# EasyEDA Pro project compute-module-v101.eprj, board base-board-5x
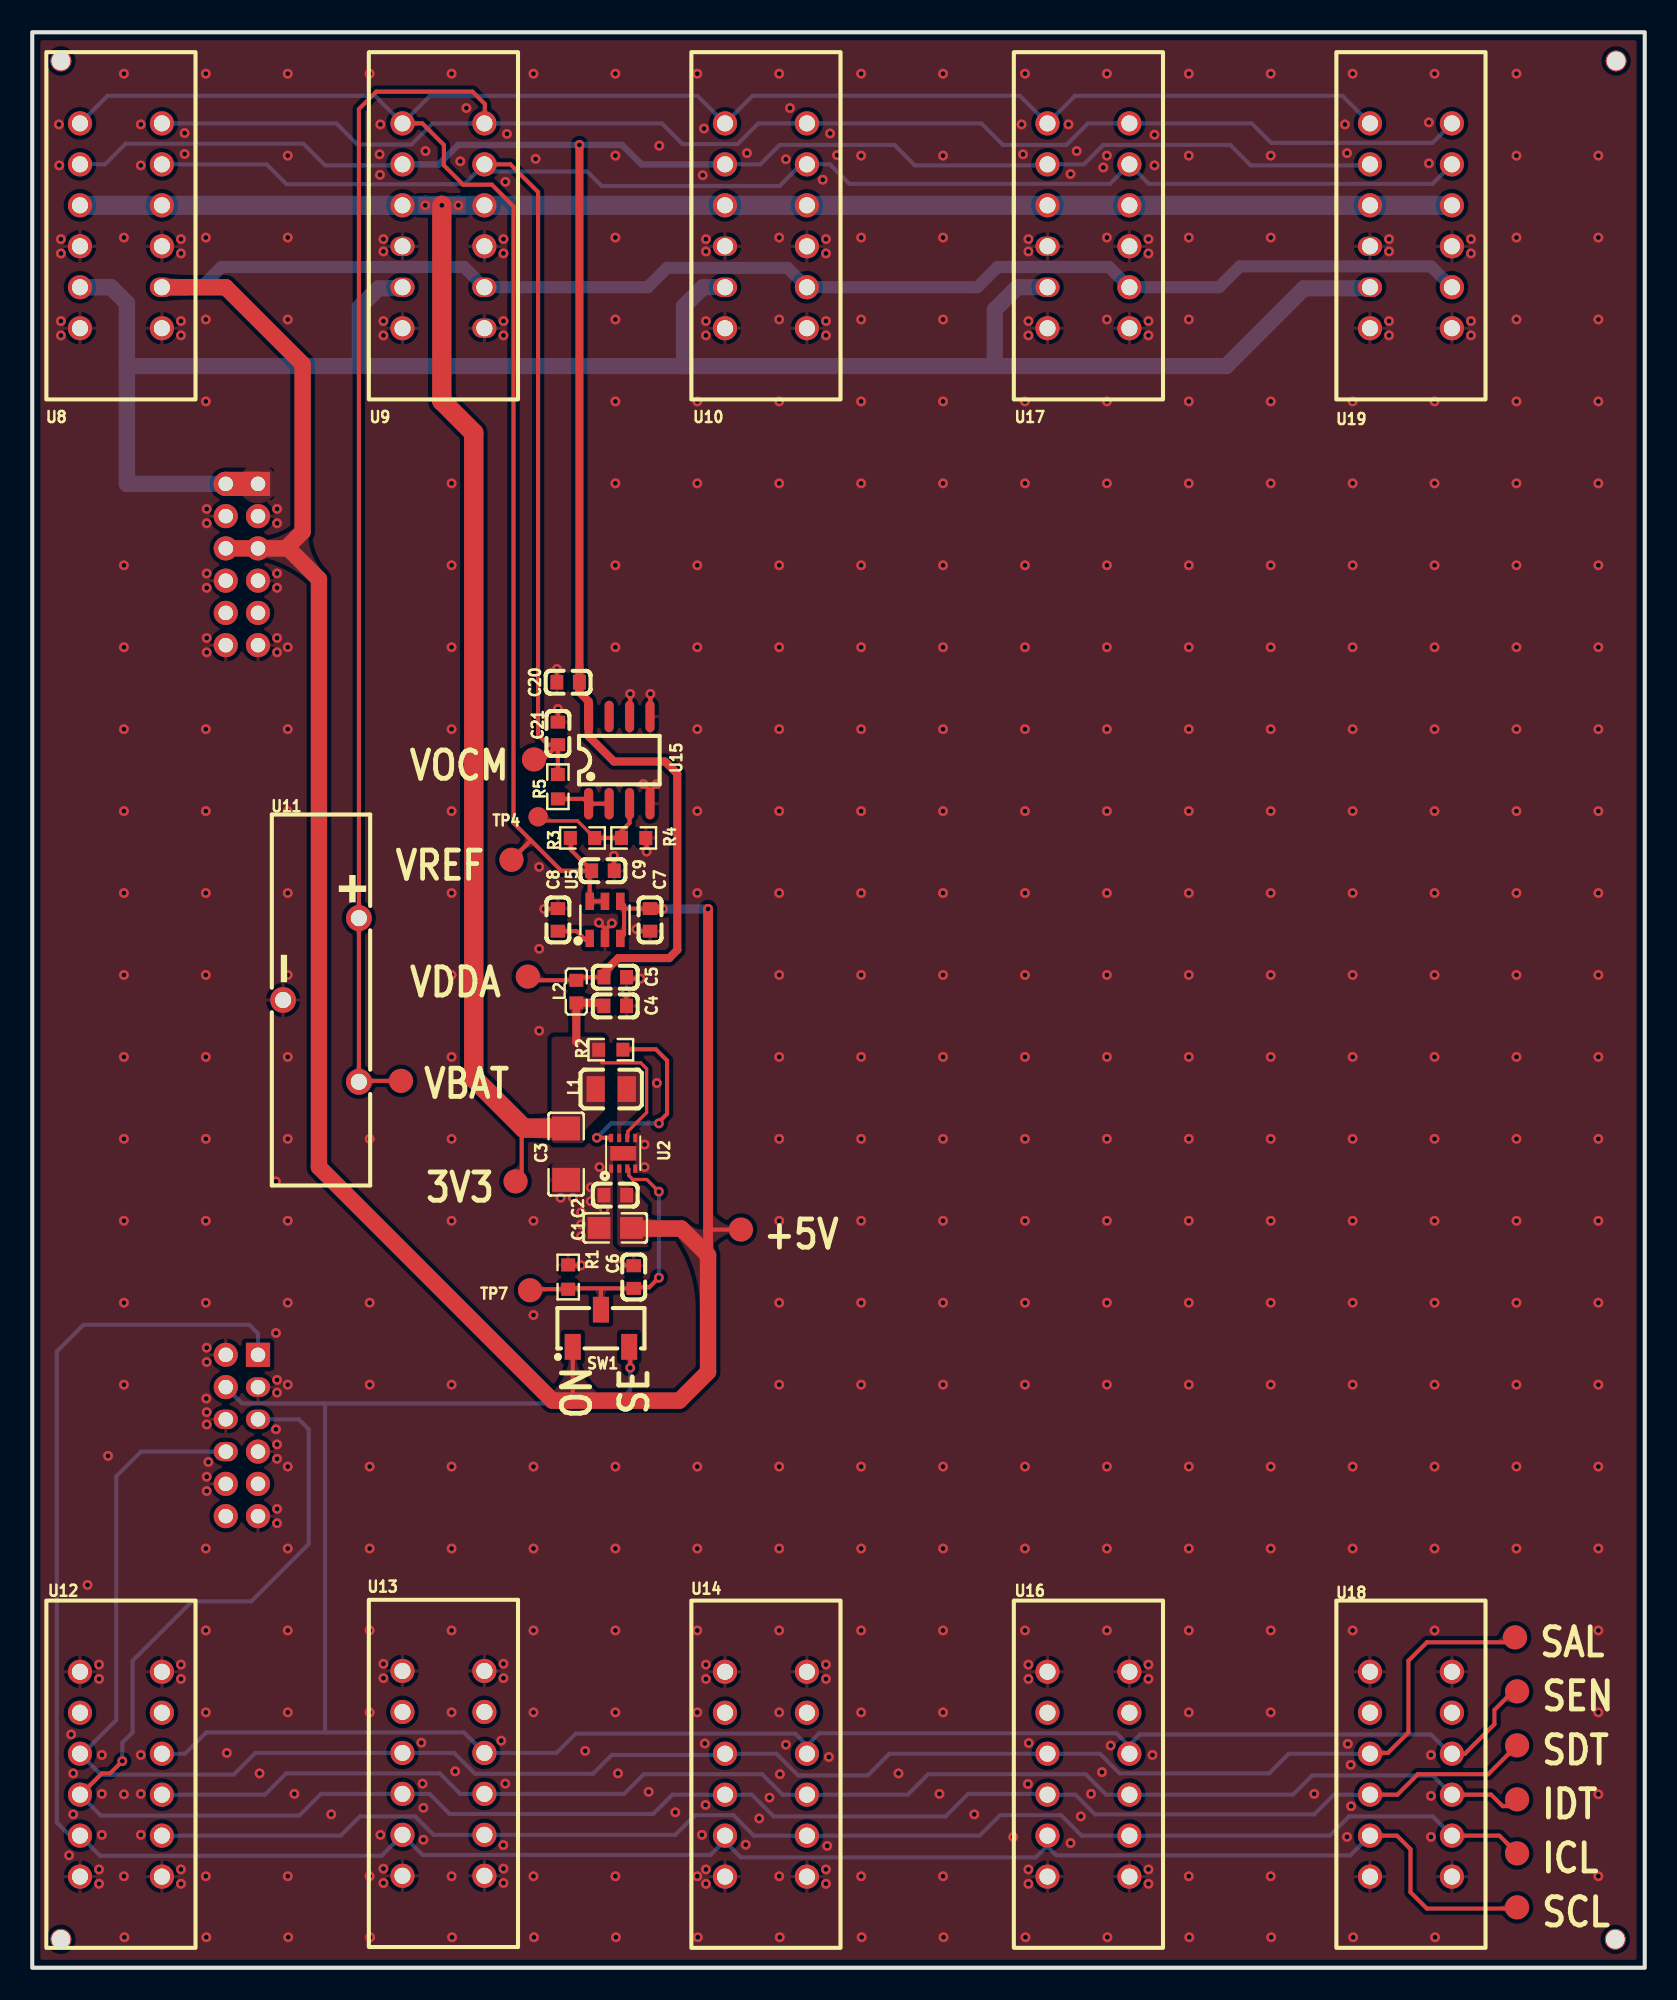
[diagram p6: board, top side]
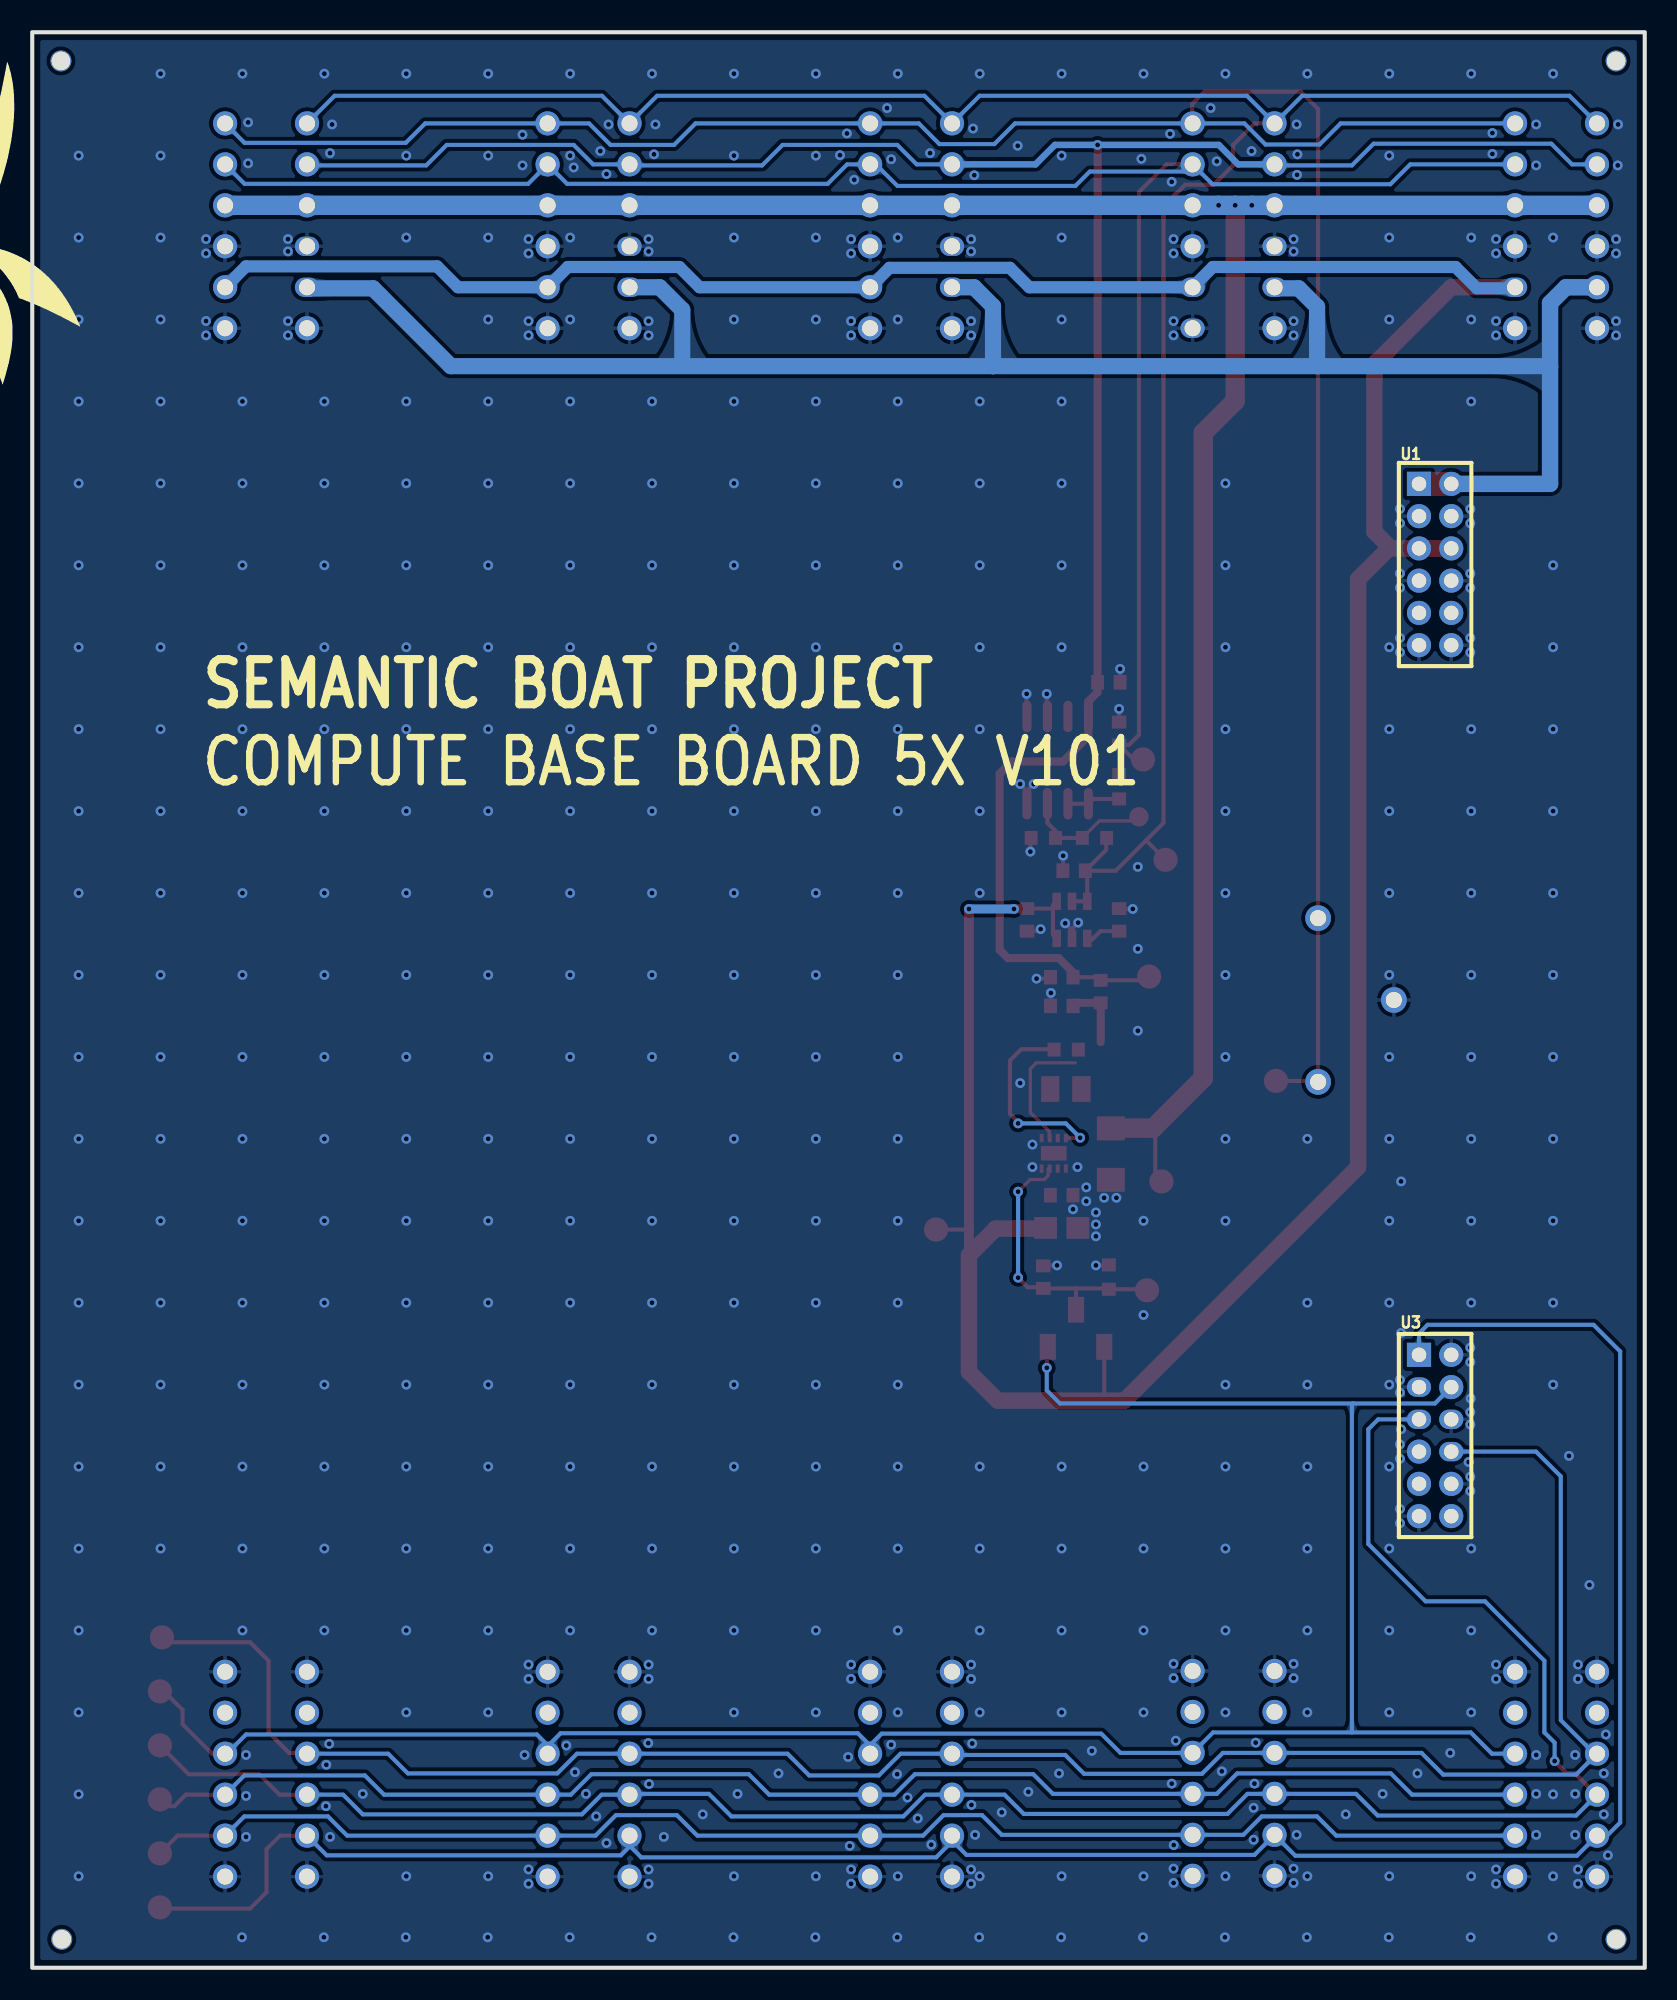
[diagram p7: board, bottom side, seen from below]

Outline 100 x 120 mm; copper layers: Top Layer, Inner1, Inner2, Bottom Layer. Coordinates in mm from the lower left corner of the outline.
Outline path: rectangle 0,120 100,0
Stack: Top Layer 0.035mm Outer layer thickness 1oz / Dielectric1 0.2104mm 7628 RC49% 8.6mil / Inner1 0.0152mm Inner layer thickness / Dielectric2 1.065mm 1.1mm H/HOZ Copper / Inner2 0.0152mm Inner layer thickness / Dielectric3 0.2104mm 7628 RC49% 8.6mil / Bottom Layer 0.035mm Outer layer thickness 1oz

## Design rules (mm)
template: JLCPCB Capability(Two Layers Board)
spacing copperThickness1oz (default): track to track 0.102, other pairs 0.152 to 0.3
spacing copperThickness2oz: track to track 0.203, other pairs 0.152 to 0.3
track width copperThickness1oz (default): min 0.127, default 0.254, max 2.54
track width copperThickness2oz: min 0.203, default 0.254, max 2.54
differential pair differentialPair (default): width min 0.127, default 0.254, max 2.54; gap min 0.152, default 0.152
via viaSize (default): diameter min 0.5, default 0.61, max 10; hole min 0.3, default 0.305, max 6.3

## Placement (name value [footprint] x y rotation side)
C1  10uF  [C0805]  36.16 45.87 180 top
C2  100nF  [C0603]  36.16 47.9 180 top
C3  22uF  [C1206]  33.11 50.44 270 top
C4  100nF  [C0603]  36.15 59.63 180 top
C5  100nF  [C0603]  36.15 61.41 180 top
C6  100nF  [C0603]  37.3 42.82 90 top
C7  100nF  [C0603]  38.31 64.97 270 top
C8  100nF  [C0603]  32.6 64.97 90 top
C9  100nF  [C0603]  35.39 68.02 0 top
C20  100nF  [C0603]  33.23 79.7 180 top
C21  2.2uF  [C0603]  32.6 76.53 90 top
L1  2.2uH  [IND-SMD_L2.0-W1.6-1]  35.9 54.48 180 top
L2  BLM18KG601SN1D  [L0603]  33.74 60.52 90 top
NOREF  -  [Pad_e13858]  98.22 118.22 180 top
NOREF#2  -  [Pad_e13859]  1.78 118.22 270 top
NOREF#3  -  [Pad_e13856]  1.78 1.76 0 top
NOREF#4  -  [Pad_e13857]  98.17 1.76 90 top
R1  100kΩ  [R0603]  33.24 42.82 90 top
R2  100kΩ  [R0603]  35.88 56.92 180 top
R3  10kΩ  [R0603]  34.12 70.05 0 top
R4  10kΩ  [R0603]  37.3 70.05 0 top
R5  10Ω  [R0603]  32.6 73.22 90 top
SW1  CAS-120A  [SW-SMD_CAS-120A]  35.27 39.65 0 top
TP1  -  [Test-Point-0.5mm#2]  29.72 68.69 0 top
TP2  -  [Test-Point-0.5mm#2]  43.95 45.77 0 top
TP3  -  [Test-Point-0.5mm#2]  31.12 74.92 0 top
TP4  -  [Test-Point-0.5mm]  31.37 71.36 0 top
TP5  -  [Test-Point-0.5mm#2]  29.97 48.75 0 top
TP6  -  [Test-Point-0.5mm#2]  30.73 61.45 0 top
TP7  -  [Test-Point-0.5mm#2]  30.87 42 0 top
TP8  -  [Test-Point-0.5mm#2]  92.08 17.13 0 top
TP9  -  [Test-Point-0.5mm#2]  91.96 20.48 0 top
TP10  -  [Test-Point-0.5mm#2]  92.08 3.74 0 top
TP11  -  [Test-Point-0.5mm#2]  92.08 13.79 0 top
TP13  -  [Test-Point-0.5mm#2]  22.87 54.99 0 top
TP14  -  [Test-Point-0.5mm#2]  92.08 7.09 0 top
TP15  -  [Test-Point-0.5mm#2]  92.08 10.44 0 top
U1  2005FV-2x6P  [HDR-TH_12P-P2.00-V-F-R2-C6-S2.00]  13 87 270 bottom
U2  TPS62162DSGR  [WSON-8_L2.0-W2.0-P0.50-TL-EP]  36.65 50.49 90 top
U3  2005FV-2x6P  [HDR-TH_12P-P2.00-V-F-R2-C6-S2.00#2]  13 33 270 bottom
U5  ZJR1001-3BUTBR  [SOT-23-6_L2.9-W1.6-P0.95-LS2.9-BL]  35.52 64.97 0 top
U8  ED12BGFBK  [CONN-TH_12P-P2.54_WINGTAT_ED12BGFBK#2]  5.5 108 90 top
U9  ED12BGFBK  [CONN-TH_12P-P2.54_WINGTAT_ED12BGFBK#3]  25.5 108 90 top
U10  ED12BGFBK  [CONN-TH_12P-P2.54_WINGTAT_ED12BGFBK]  45.5 108 90 top
U11  VBH2032-1  [BAT-TH_3P-L23.0-W6.0_VBH2032-1]  17.91 60 270 top
U12  ED12BGFBK  [CONN-TH_12P-P2.54_WINGTAT_ED12BGFBK#4]  5.5 12 90 top
U13  ED12BGFBK  [CONN-TH_12P-P2.54_WINGTAT_ED12BGFBK#4]  25.5 12.05 90 top
U14  ED12BGFBK  [CONN-TH_12P-P2.54_WINGTAT_ED12BGFBK#4]  45.5 12 90 top
U15  TLV9062IDR  [SOIC-8_L5.0-W4.0-P1.27-LS6.0-BL]  36.41 74.87 0 top
U16  ED12BGFBK  [CONN-TH_12P-P2.54_WINGTAT_ED12BGFBK#4]  65.5 12 90 top
U17  ED12BGFBK  [CONN-TH_12P-P2.54_WINGTAT_ED12BGFBK]  65.5 108 90 top
U18  ED12BGFBK  [CONN-TH_12P-P2.54_WINGTAT_ED12BGFBK#4]  85.5 12 90 top
U19  ED12BGFBK  [CONN-TH_12P-P2.54_WINGTAT_ED12BGFBK]  85.5 108 90 top

## Footprints (pads in the part's own frame, mm; a bottom-side part is the same pattern mirrored in y, then rotated)
BAT-TH_3P-L23.0-W6.0_VBH2032-1
  round 1.6 hole 1: 1(-5.075,2.35) 2(5.075,2.35) 3(0,-2.35)
C0603
  rect 0.8x0.9 smd: 1(-0.7,0) 2(0.7,0)
C0805
  rect 1.41x1.35 smd: 1(-1,0) 2(1,0)
C1206
  rect 1.485x1.728 smd: 1(-1.593,0) 2(1.593,0)
CONN-TH_12P-P2.54_WINGTAT_ED12BGFBK
  round 1.5 hole 1: 1(-6.35,2.54) 4(1.27,2.54) 5(3.81,2.54) 6(6.35,2.54) 7(6.35,-2.54) 8(3.81,-2.54) 9(1.27,-2.54) 10(-1.27,-2.54) 11(-3.81,-2.54) 12(-6.35,-2.54)
  oval 1.2x1.5 hole 1: 2(-3.81,2.54) 3(-1.27,2.54)
CONN-TH_12P-P2.54_WINGTAT_ED12BGFBK#2
  round 1.5 hole 1: 1(-6.35,2.54) 2(-3.81,2.54) 3(-1.27,2.54) 4(1.27,2.54) 5(3.81,2.54) 6(6.35,2.54) 7(6.35,-2.54) 8(3.81,-2.54) 9(1.27,-2.54) 10(-1.27,-2.54) 12(-6.35,-2.54)
  oval 1.2x1.5 hole 1: 11(-3.81,-2.54)
CONN-TH_12P-P2.54_WINGTAT_ED12BGFBK#3
  round 1.5 hole 1: 1(-6.35,2.54) 4(1.27,2.54) 5(3.81,2.54) 6(6.35,2.54) 7(6.35,-2.54) 8(3.81,-2.54) 9(1.27,-2.54) 10(-1.27,-2.54)
  oval 1.2x1.5 hole 1: 2(-3.81,2.54) 3(-1.27,2.54) 11(-3.81,-2.54) 12(-6.35,-2.54)
CONN-TH_12P-P2.54_WINGTAT_ED12BGFBK#4
  round 1.5 hole 1: 1(-6.35,2.54) 2(-3.81,2.54) 3(-1.27,2.54) 4(1.27,2.54) 5(3.81,2.54) 6(6.35,2.54) 7(6.35,-2.54) 8(3.81,-2.54) 9(1.27,-2.54) 10(-1.27,-2.54) 11(-3.81,-2.54) 12(-6.35,-2.54)
HDR-TH_12P-P2.00-V-F-R2-C6-S2.00
  rect 1.5x1.5 hole 0.9: 1(-5,-1)
  round 1.5 hole 0.9: 2(-5,1) 3(-3,-1) 4(-3,1) 5(-1,-1) 6(-1,1) 7(1,-1) 8(1,1) 9(3,-1) 10(3,1) 11(5,-1) 12(5,1)
HDR-TH_12P-P2.00-V-F-R2-C6-S2.00#2
  rect 1.5x1.5 hole 0.9: 1(-5,-1)
  round 1.5 hole 0.9: 2(-5,1) 4(-3,1) 7(1,-1) 9(3,-1) 10(3,1) 11(5,-1) 12(5,1)
  oval 1.2x1.5 hole 0.9: 3(-3,-1) 5(-1,-1) 6(-1,1) 8(1,1)
IND-SMD_L2.0-W1.6-1
  rect 1.133x1.6 smd: 1(-0.967,0) 2(0.967,0)
L0603
  rect 0.8x0.864 smd: 1(-0.7,0) 2(0.7,0)
Pad_e13856
  round 1.3 hole 1.152: 1(0,0)
Pad_e13857
  round 1.3 hole 1.152: 1(0,0)
Pad_e13858
  round 1.3 hole 1.152: 1(0,0)
Pad_e13859
  round 1.3 hole 1.152: 1(0,0)
R0603
  rect 0.806x0.864 smd: 1(-0.753,0) 2(0.753,0)
SOIC-8_L5.0-W4.0-P1.27-LS6.0-BL
  oval 0.569x1.95 smd: 1(-1.905,-2.705) 2(-0.635,-2.705) 3(0.635,-2.705) 4(1.905,-2.705) 5(1.905,2.705) 6(0.635,2.705) 7(-0.635,2.705) 8(-1.905,2.705)
SOT-23-6_L2.9-W1.6-P0.95-LS2.9-BL
  rect 0.532x1.072 smd: 1(-0.95,-1.149) 2(0,-1.149) 3(0.95,-1.149) 4(0.95,1.149) 5(0,1.149) 6(-0.95,1.149)
SW-SMD_CAS-120A
  rect 1x1.6 smd: 1(-1.75,-1.15) 2(0,1.15) 3(1.75,-1.15)
Test-Point-0.5mm
  round 1.2 smd: 1(0,0)
Test-Point-0.5mm#2
  round 1.5 smd: 1(0,0)
WSON-8_L2.0-W2.0-P0.50-TL-EP
  rect 0.521x0.25 smd: 1(-0.95,0.75) 2(-0.95,0.25) 3(-0.95,-0.25) 4(-0.95,-0.75) 5(0.95,-0.75) 6(0.95,-0.25) 7(0.95,0.25) 8(0.95,0.75)
  rect 0.9x1.6 smd: 9(0,0)

## Nets
As in the schematic.

Pads without a net: NOREF 1; NOREF#2 1; NOREF#3 1; NOREF#4 1; U1 9 10; U3 9 12; U12 5 8; U13 5 8; U14 5 8; U15 7; U16 5 8; U18 5 8

## Via types
v1: diameter 0.61, hole 0.305, Top Layer to Bottom Layer, 586 vias

## Routing (per net, layer and track width the routed paths; a pad name or vN(x,y) marks a point on that pad's centre or on a via; arc(x,y) is an arc through that point)
+3V3: length 162.2
  Top Layer w0.2: U2.6 36.9,51.49 36.93,51.52 36.93,51.85 37.55,52.47 37.55,52.47 38.1,53.02 38.1,55.74 37.73,56.11 35.32,56.11
  Top Layer w0.254: TP5.1 30.35,49.13 30.35,51.8
  Top Layer w0.5: C4.2 35.26,59.82 L2.1 33.74,57.39
  Top Layer w1.2: v1(25.4,109.27) 25.4,97.14 27.38,95.16 27.38,55.16 30.48,52.06 33.09,52.06 C3.1
  Bottom Layer w1.2: U19.9 U19.4 U17.9 U17.4 U10.9 U10.4 U9.9 v1(26.43,109.27) v1(25.4,109.27) v1(24.37,109.27) U9.4 U8.9 U8.4
+5V: length 227.9
  Top Layer w0.254: C7.1 36.73,65.67 36.7,65.64 ; SW1.1 33.52,35.18 33.5,35.16 ; U5.4 36.7,65.88 36.7,65.64 ; 36.7,65.64 36.7,64.05 U5.3 ; TP2.1 41.85,45.77 41.78,45.7
  Top Layer w0.559: C7.1 38.34,65.64 v1(39.12,65.64)
  Top Layer w0.61: 41.91,44.17 v1(41.91,65.64)
  Top Layer w1.016: 15.88,88 17.78,86.09 17.78,49.64 32.26,35.16 40.13,35.16 41.91,36.94 41.91,44.17 40.25,45.83 37.2,45.83 C1.1 ; U8.11 12,104.19 16.76,99.43 16.76,89.03 15.73,88 U1.5 U1.6
  Bottom Layer w0.559: v1(41.91,65.64) v1(39.12,65.64)
  Bottom Layer w0.75: U19.11 86.75,105.48 74.89,105.48 73.6,104.19 U17.11 66.78,105.45 59.87,105.45 58.61,104.19 U10.11 46.84,105.39 39.37,105.39 38.16,104.19 U9.11 26.78,105.45 11.73,105.45 10.41,104.12 8.11,104.12 U8.11
+12V: length 122.6
  Top Layer w1.5: U1.2 U1.1
  Bottom Layer w1: U9.2 22.89,104.12 21.46,104.12 20.32,102.98 20.32,99.3 ; 59.69,99.43 59.69,102.79 61.09,104.19 U17.2 ; 40.42,99.3 40.42,99.3 40.42,103.01 41.59,104.19 U10.2 ; 40.42,99.3 74.04,99.3 78.87,104.12 82.9,104.12 U19.2 ; 40.42,99.3 20.32,99.3 ; 20.32,99.3 5.9,99.3 5.87,99.27
  Bottom Layer w1.016: U8.2 4.89,104.19 5.87,103.21 5.87,92 U1.2
GND: length 15.2
  Top Layer w0.254: U15.5 38.33,77.6 v1(38.33,78.98) ; v1(37.47,64.39) 37.59,64.27 C7.2 ; v1(38.74,73.39) 38.31,72.97 ; 38.31,72.97 38.31,72.97 v1(37.9,73.39) ; 38.31,72.97 U15.4 ; v1(32.6,78.05) 32.6,77.22 ; C9.2 36.07,68.04 v1(36.07,68.95) ; R1.2 33.27,43.55 v1(34.04,43.55) ; v1(38.1,69.2) 38.1,70 R4.2 ; v1(35.14,64.8) 35.52,64.42 35.52,64.33 ; C8.2 32.57,65.64 v1(31.75,65.64) ; 37.04,77.58 37.08,77.62 v1(37.08,78.98) ; v1(36.83,60.44) 36.83,59.66 C4.1 ; C5.1 36.94,61.33 v1(37.72,61.33) ; 35.52,64.33 U5.2 ; 35.52,64.33 v1(35.94,64.75) ; 32.53,79.7 32.54,79.7 v1(32.54,80.53) ; C6.2 37.28,43.55 v1(36.45,43.55)
  vias: v1(1.65,114.28) v1(1.68,111.75) v1(1.78,107.17) v1(1.78,106.28) v1(1.78,102.09) v1(1.78,101.2) v1(2.29,6.97) v1(2.41,14.46) v1(2.54,12.05) v1(2.54,9.51) v1(3.43,23.73) v1(4.14,18.8) v1(4.14,17.91) v1(4.14,6.1) v1(4.14,5.21) v1(4.32,13.19) v1(4.32,10.78) v1(4.32,8.24) v1(4.7,31.74) v1(5.68,117.43) v1(5.68,107.27) v1(5.68,86.95) v1(5.68,81.87) v1(5.68,76.79) v1(5.68,71.71) v1(5.68,66.63) v1(5.68,61.55) v1(5.68,56.47) v1(5.68,51.39) v1(5.68,46.31) v1(5.68,41.23) v1(5.68,36.15) v1(5.68,10.75) v1(5.68,5.67) v1(5.72,1.89) v1(6.73,114.28) v1(6.73,111.75) v1(6.73,13.19) v1(6.73,10.78) v1(6.73,8.24) v1(9.22,107.18) v1(9.22,106.29) v1(9.22,102.1) v1(9.22,101.21) v1(9.22,18.8) v1(9.22,17.91) v1(9.22,6.1) v1(9.22,5.21) v1(9.45,113.75) v1(9.45,112.46) v1(10.76,117.43) v1(10.76,107.27) v1(10.76,102.19) v1(10.76,97.11) v1(10.82,90.44) v1(10.82,89.55) v1(10.82,86.44) v1(10.82,85.55) v1(10.82,82.44) v1(10.82,81.55) v1(10.76,76.79) v1(10.76,71.71) v1(10.76,66.63) v1(10.76,61.55) v1(10.76,56.47) v1(10.76,51.39) v1(10.76,46.31) v1(10.76,41.23) v1(10.82,38.44) v1(10.82,37.55) v1(10.8,35.29) v1(10.82,34.44) v1(10.82,33.68) v1(10.82,30.44) v1(10.82,29.55) v1(10.76,25.99) v1(10.76,20.91) v1(10.76,15.83) v1(10.76,5.67) v1(10.8,1.89) v1(10.92,31.35) v1(12.06,13.32) v1(14.1,12.05) v1(15.11,48.75) v1(15.11,39.35) v1(15.11,33.39) v1(15.18,90.45) v1(15.18,89.56) v1(15.18,86.45) v1(15.18,85.56) v1(15.18,82.45) v1(15.18,81.56) v1(15.18,36.45) v1(15.18,35.66) v1(15.18,32.45) v1(15.18,31.56) v1(15.18,28.45) v1(15.18,27.56) v1(15.84,117.43) v1(15.84,112.35) v1(15.84,107.27) v1(15.84,102.19) v1(15.84,81.87) v1(15.84,76.79) v1(15.84,71.71) v1(15.84,66.63) v1(15.84,61.55) v1(15.84,56.47) v1(15.84,51.39) v1(15.84,46.31) v1(15.84,41.23) v1(15.84,36.15) v1(15.84,31.07) v1(15.84,25.99) v1(15.84,20.91) v1(15.84,15.83) v1(15.84,5.67) v1(15.88,1.89) v1(16.26,10.78) v1(18.54,9.51) v1(20.92,117.43) v1(20.92,51.39) v1(20.92,41.23) v1(20.92,36.15) v1(20.92,31.07) v1(20.92,25.99) v1(20.92,20.91) v1(20.92,15.83) v1(20.92,5.67) v1(20.95,1.89) v1(21.54,112.43) v1(21.59,114.28) v1(21.56,111.16) v1(21.59,8.24) v1(21.78,107.17) v1(21.78,106.41) v1(21.78,102.09) v1(21.78,101.2) v1(21.78,18.84) v1(21.78,17.95) v1(21.78,6.14) v1(21.78,5.25) v1(24.13,13.96) v1(24.21,11.41) v1(24.26,9.92) v1(24.26,7.94) v1(24.38,112.63) v1(26,117.43) v1(26,92.03) v1(26,86.95) v1(26,81.87) v1(26,76.79) v1(26,71.71) v1(26,66.63) v1(26,61.55) v1(26,56.47) v1(26,51.39) v1(26,46.31) v1(26,36.15) v1(26,31.07) v1(26,25.99) v1(26,20.91) v1(26,15.83) v1(26,5.67) v1(26.03,1.89) v1(26.23,12.18) v1(26.54,112) v1(26.92,115.3) v1(29.08,14.08) v1(29.22,107.18) v1(29.22,106.29) v1(29.22,102.1) v1(29.22,101.21) v1(29.22,18.85) v1(29.22,17.96) v1(29.21,7.6) v1(29.22,6.15) v1(29.22,5.26) v1(29.34,110.73) v1(29.34,11.41) v1(29.44,113.7) v1(31.08,117.43) v1(31.08,46.31) v1(31.08,40.47) v1(31.08,31.07) v1(31.08,25.99) v1(31.08,20.91) v1(31.08,15.83) v1(31.08,5.67) v1(31.12,1.89) v1(31.22,112.15) v1(31.44,68.25) v1(31.44,63.17) v1(31.44,58.09) v1(32.77,47.74) v1(33.53,47.74) v1(34.04,46.83) v1(34.04,46.08) v1(34.04,45.35) v1(34.29,13.45) v1(34.63,48.38) v1(34.63,47.52) v1(35.18,49.64) v1(35.46,47.03) v1(36.16,117.43) v1(36.16,112.35) v1(36.16,107.27) v1(36.16,102.19) v1(36.16,97.11) v1(36.16,92.03) v1(36.16,86.95) v1(36.16,81.87) v1(36.16,31.07) v1(36.16,25.99) v1(36.16,20.91) v1(36.16,15.83) v1(36.16,5.67) v1(36.19,1.89) v1(36.32,12.05) v1(37.97,51.04) v1(37.97,49.64) v1(38.23,10.91) v1(38.74,54.85) v1(38.89,112.96) v1(39.88,9.64) v1(41.24,117.43) v1(41.24,97.11) v1(41.24,92.03) v1(41.24,86.95) v1(41.24,81.87) v1(41.24,76.79) v1(41.24,71.71) v1(41.24,66.63) v1(41.24,31.07) v1(41.24,25.99) v1(41.24,20.91) v1(41.24,15.83) v1(41.24,5.67) v1(41.28,1.89) v1(41.53,8.24) v1(41.58,111.14) v1(41.66,114.03) v1(41.71,13.9) v1(41.78,107.17) v1(41.78,106.41) v1(41.78,102.09) v1(41.78,101.2) v1(41.78,18.79) v1(41.78,17.9) v1(41.76,10.09) v1(41.78,6.09) v1(41.78,5.2) v1(44.25,7.63) v1(44.32,112.51) v1(45.09,9.26) v1(45.72,10.55) v1(46.32,117.43) v1(46.32,107.27) v1(46.32,102.19) v1(46.32,97.11) v1(46.32,92.03) v1(46.32,86.95) v1(46.32,81.87) v1(46.32,76.79) v1(46.32,71.71) v1(46.32,66.63) v1(46.32,61.55) v1(46.32,56.47) v1(46.32,51.39) v1(46.32,46.31) v1(46.32,41.23) v1(46.32,36.15) v1(46.32,31.07) v1(46.32,25.99) v1(46.32,20.91) v1(46.32,15.83) v1(46.32,5.67) v1(46.37,12) v1(46.35,1.89) v1(46.74,112.13) v1(46.74,13.83) v1(46.99,115.3) v1(49.02,110.86) v1(49.22,107.18) v1(49.22,106.29) v1(49.22,102.1) v1(49.22,101.21) v1(49.22,18.8) v1(49.22,17.91) v1(49.22,6.1) v1(49.22,5.21) v1(49.3,7.55) v1(49.4,13.07) v1(49.48,113.73) v1(49.91,112.38) v1(51.4,117.43) v1(51.4,112.35) v1(51.4,107.27) v1(51.4,102.19) v1(51.4,97.11) v1(51.4,92.03) v1(51.4,86.95) v1(51.4,81.87) v1(51.4,76.79) v1(51.4,71.71) v1(51.4,66.63) v1(51.4,61.55) v1(51.4,56.47) v1(51.4,51.39) v1(51.4,46.31) v1(51.4,41.23) v1(51.4,36.15) v1(51.4,31.07) v1(51.4,25.99) v1(51.4,20.91) v1(51.4,15.83) v1(51.4,5.67) v1(51.44,1.89) v1(53.72,12.05) v1(56.26,10.78) v1(56.48,117.43) v1(56.48,112.35) v1(56.48,107.27) v1(56.48,102.19) v1(56.48,97.11) v1(56.48,92.03) v1(56.48,86.95) v1(56.48,81.87) v1(56.48,76.79) v1(56.48,71.71) v1(56.48,66.63) v1(56.48,61.55) v1(56.48,56.47) v1(56.48,51.39) v1(56.48,46.31) v1(56.48,41.23) v1(56.48,36.15) v1(56.48,31.07) v1(56.48,25.99) v1(56.48,20.91) v1(56.48,15.83) v1(56.48,5.67) v1(56.51,1.89) v1(58.42,9.51) v1(60.83,8.11) v1(61.35,114.28) v1(61.44,112.43) v1(61.56,117.43) v1(61.56,97.11) v1(61.56,92.03) v1(61.56,86.95) v1(61.56,81.87) v1(61.56,76.79) v1(61.56,71.71) v1(61.56,66.63) v1(61.56,61.55) v1(61.56,56.47) v1(61.56,51.39) v1(61.56,46.31) v1(61.56,41.23) v1(61.56,36.15) v1(61.56,31.07) v1(61.56,25.99) v1(61.56,20.91) v1(61.59,1.89) v1(61.75,11.39) v1(61.78,107.17) v1(61.78,106.41) v1(61.78,102.09) v1(61.78,101.2) v1(61.78,18.79) v1(61.78,17.9) v1(61.8,13.93) v1(61.78,6.09) v1(61.78,5.2) v1(64.26,114.28) v1(64.39,111.21) v1(64.39,7.73) v1(64.77,112.63) v1(65.02,9.38) v1(65.66,10.78) v1(66.34,12.13) v1(66.42,111.62) v1(66.64,117.43) v1(66.64,112.35) v1(66.64,107.27) v1(66.64,102.19) v1(66.64,97.11) v1(66.64,92.03) v1(66.64,86.95) v1(66.64,81.87) v1(66.64,76.79) v1(66.64,71.71) v1(66.64,66.63) v1(66.64,61.55) v1(66.64,56.47) v1(66.64,51.39) v1(66.64,46.31) v1(66.64,41.23) v1(66.64,36.15) v1(66.64,31.07) v1(66.64,25.99) v1(66.64,20.91) v1(66.68,1.89) v1(66.88,13.78) v1(69.22,107.18) v1(69.22,106.29) v1(69.22,102.1) v1(69.22,101.21) v1(69.22,18.8) v1(69.22,17.91) v1(69.22,6.1) v1(69.22,5.21) v1(69.47,13.19) v1(69.6,113.65) v1(69.6,111.75) v1(71.72,117.43) v1(71.72,112.35) v1(71.72,107.27) v1(71.72,102.19) v1(71.72,97.11) v1(71.72,92.03) v1(71.72,86.95) v1(71.72,81.87) v1(71.72,76.79) v1(71.72,71.71) v1(71.72,66.63) v1(71.72,61.55) v1(71.72,56.47) v1(71.72,51.39) v1(71.72,46.31) v1(71.72,41.23) v1(71.72,36.15) v1(71.72,31.07) v1(71.72,25.99) v1(71.72,20.91) v1(71.72,15.83) v1(71.72,5.67) v1(71.75,1.89) v1(76.8,117.43) v1(76.8,112.35) v1(76.8,107.27) v1(76.8,97.11) v1(76.8,92.03) v1(76.8,86.95) v1(76.8,81.87) v1(76.8,76.79) v1(76.8,71.71) v1(76.8,66.63) v1(76.8,61.55) v1(76.8,56.47) v1(76.8,51.39) v1(76.8,46.31) v1(76.8,41.23) v1(76.8,36.15) v1(76.8,31.07) v1(76.8,25.99) v1(76.8,20.91) v1(76.8,15.83) v1(76.8,5.67) v1(76.84,1.89) v1(79.5,10.78) v1(81.41,114.28) v1(81.53,112.51) v1(81.53,8.11) v1(81.59,13.88) v1(81.76,12.58) v1(81.79,10.02) v1(81.88,117.43) v1(81.88,97.11) v1(81.88,92.03) v1(81.88,86.95) v1(81.88,81.87) v1(81.88,76.79) v1(81.88,71.71) v1(81.88,66.63) v1(81.88,61.55) v1(81.88,56.47) v1(81.88,51.39) v1(81.88,46.31) v1(81.88,41.23) v1(81.88,36.15) v1(81.88,31.07) v1(81.88,25.99) v1(81.88,20.91) v1(81.91,1.89) v1(84.14,107.18) v1(84.14,106.41) v1(84.14,102.1) v1(84.14,101.21) v1(86.61,114.41) v1(86.61,111.87) v1(86.74,13.19) v1(86.74,10.65) v1(86.74,8.11) v1(86.96,117.43) v1(86.96,97.11) v1(86.96,92.03) v1(86.96,86.95) v1(86.96,81.87) v1(86.96,76.79) v1(86.96,71.71) v1(86.96,66.63) v1(86.96,61.55) v1(86.96,56.47) v1(86.96,51.39) v1(86.96,46.31) v1(86.96,41.23) v1(86.96,36.15) v1(86.96,31.07) v1(86.96,25.99) v1(86.96,20.91) v1(87,1.89) v1(89.22,107.18) v1(89.22,106.29) v1(89.22,102.1) v1(89.22,101.21) v1(92.04,117.43) v1(92.04,112.35) v1(92.04,107.27) v1(92.04,102.19) v1(92.04,97.11) v1(92.04,92.03) v1(92.04,86.95) v1(92.04,81.87) v1(92.04,76.79) v1(92.04,71.71) v1(92.04,66.63) v1(92.04,61.55) v1(92.04,56.47) v1(92.04,51.39) v1(92.04,46.31) v1(92.04,41.23) v1(92.04,36.15) v1(92.04,31.07) v1(92.04,25.99) v1(97.12,112.35) v1(97.12,107.27) v1(97.12,102.19) v1(97.12,97.11) v1(97.12,92.03) v1(97.12,86.95) v1(97.12,81.87) v1(97.12,76.79) v1(97.12,71.71) v1(97.12,66.63) v1(97.12,61.55) v1(97.12,56.47) v1(97.12,51.39) v1(97.12,46.31) v1(97.12,41.23) v1(97.12,36.15) v1(97.12,31.07) v1(97.12,25.99) v1(97.12,20.91) v1(97.12,15.83) v1(97.12,10.75) v1(97.12,5.67)
VBAT: length 157
  Top Layer w0.254: TP13.1 20.32,54.99 U11.2 U11.1 20.26,115.24 21.34,116.32 27.31,116.32 28.07,115.56 28.07,114.38 U9.7
  Bottom Layer w0.254: U19.7 86.83,113.14 76.84,113.14 75.63,114.35 U17.7 65.47,114.35 64.13,113.02 60.2,113.02 58.86,114.35 U10.7 45.02,114.35 43.74,113.07 40.34,113.07 39.05,114.35 U9.7 24.83,114.35 23.52,113.04 20.17,113.04 18.86,114.35 U8.7
VDDA: length 148.8
  Top Layer w0.254: TP6.1 30.96,61.22 L2.2 33.93,61.41 C5.2
  Top Layer w0.5: v1(33.93,113.02) C20.1 33.93,79.08 34.5,78.51 U15.8 34.5,76.35 36.07,74.79 39.24,74.79 40,74.03 40,63.1 39.5,62.6 36.34,62.6 35.45,61.71 C5.2
  Bottom Layer w0.254: U19.5 82.9,111.75 75.56,111.75 74.29,113.02 66.42,113.02 65.22,111.81 U17.5 62.9,111.75 54.74,111.75 53.47,113.02 46.35,113.02 45.15,111.81 U10.5 ; U8.5 4.51,111.81 5.79,113.09 16.81,113.09 18.16,111.75 22.89,111.75 U9.5
  Bottom Layer w0.4: U9.5 25.21,111.81 26.42,113.02 v1(33.93,113.02) 36.58,113.02 37.78,111.81 U10.5
I2C_SCL: length 88.5
  Top Layer w0.254: TP14.1 90.98,8.19 U18.11
  Bottom Layer w0.254: U18.11 86.85,9.38 81.66,9.38 80.47,8.19 U16.11 65.07,8.19 63.81,9.46 60.02,9.46 58.75,8.19 U14.11 44.75,8.19 43.49,9.46 41.1,9.46 39.88,8.24 U13.11 24.89,8.24 23.75,9.38 20.32,9.38 19.13,8.19 U12.11
I2C_SDA: length 88.7
  Top Layer w0.254: U18.10 90.47,10.73 91.19,10.02 91.66,10.02 TP15.1
  Bottom Layer w0.254: U12.10 14.43,10.73 15.75,12.05 25.27,12.05 26.54,10.78 U13.10 36.7,10.78 37.92,12 45.26,12 46.53,10.73 U14.10 54.29,10.73 55.56,12 65.33,12 66.6,10.73 U16.10 78.18,10.73 79.38,11.92 86.85,11.92 U18.10
SMB_ALERT: length 124.5
  Top Layer w0.254: U18.4 83.01,13.32 84.07,13.32 85.34,14.59 85.34,19.03 86.49,20.18 91.65,20.18 TP9.1
  Bottom Layer w0.254: U18.4 77.93,13.27 76.71,12.05 67.44,12.05 66.22,13.27 U16.4 53.16,13.27 51.82,11.92 47.5,11.92 46.15,13.27 U14.4 42.88,13.19 35.94,13.19 34.77,12.02 27.46,12.02 26.16,13.32 U13.4 13.84,13.32 12.5,11.97 4.26,11.97 U12.4 3.12,13.27 5.21,15.35 5.21,30.47 6.74,32 U3.8
SMB_CLK: length 142.7
  Top Layer w0.254: TP10.1 92.01,3.67 86.49,3.67 85.47,4.68 85.47,7.35 84.63,8.19 U18.2
  Bottom Layer w0.254: U3.1 14,39.32 13.46,39.86 3.17,39.86 1.52,38.21 1.52,9 2.34,8.19 U12.2 4.21,6.94 21.66,6.94 U13.2 24.2,7 42.06,7 42.96,7.89 ; U16.2 62.96,7.57 ; 62.96,7.57 62.23,6.84 43.94,6.84 42.96,7.82 42.96,7.89 ; 62.96,7.57 62.96,7.51 63.5,6.97 81.74,6.97 U18.2 ; 42.96,7.89 U14.2
SMB_DATA: length 129.1
  Top Layer w0.254: v1(5.59,12.81) 4.83,12.05 4.32,12.05 3,10.73 U12.3 ; U18.3 84.66,10.73 85.93,12 90.3,12 TP11.1
  Bottom Layer w0.254: U3.5 16.53,34 17.14,33.39 17.14,26.27 13.59,22.72 9.91,22.72 6.22,19.03 6.22,14.59 5.59,13.96 v1(5.59,12.81) ; U12.3 4.26,9.43 16.56,9.43 17.91,10.78 U13.3 24.64,10.78 25.88,9.54 38.51,9.54 39.7,10.73 U14.3 44.63,10.73 45.97,9.38 56.64,9.38 58.04,10.78 62.91,10.78 U16.3 64.69,10.73 65.91,9.51 79.5,9.51 80.72,10.73 U18.3
STACK_ENABLE: length 139.5
  Top Layer w0.254: TP8.1 92.02,17.07 91.76,17.07 90.68,15.99 90.68,15.1 88.85,13.27 U18.9 ; SW1.3 37.08,38.43 v1(37.08,37.2)
  Bottom Layer w0.254: 18.08,34.99 36.27,34.99 37.08,35.8 v1(37.08,37.2) ; 18.08,34.99 18.16,34.91 18.16,14.59 ; 18.08,34.99 13.01,34.99 U3.4 ; 48.04,13.78 U14.9 ; 48.04,13.78 48.8,14.54 67.23,14.54 68.04,13.73 ; 48.04,13.78 48.04,13.79 47.32,14.51 33.71,14.51 32.51,13.32 U13.9 26.77,14.59 18.16,14.59 ; 18.16,14.59 10.8,14.59 9.47,13.27 U12.9 ; U16.9 68.04,13.73 ; 68.04,13.73 68.04,13.8 68.71,14.46 86.74,14.46 87.93,13.27 U18.9
VOCM: length 127
  Top Layer w0.254: C21.1 R5.2 ; C21.1 31.98,75.83 31.37,76.44 31.37,110.09 29.65,111.81 U9.8 ; C21.1 31.69,74.92 TP3.1
  Bottom Layer w0.254: U8.8 14.54,111.81 15.77,110.58 26.81,110.58 U9.8 28.49,111.36 34.42,111.36 35.31,110.47 46.35,110.47 47.68,111.81 U10.8 49.47,111.81 50.67,110.6 66.83,110.6 U17.8 69.25,110.6 86.83,110.6 U19.8
VREF: length 146.9
  Top Layer w0.254: U9.6 24.19,114.35 25.53,113.02 25.53,111.75 26.73,110.55 28.5,110.55 29.84,109.2 29.84,70.98 30.91,69.92 ; U5.5 34.57,66.12 34.57,67.89 C9.1 ; 30.91,69.92 32.81,68.02 C9.1 ; 30.91,69.92 30.91,69.88 TP1.1 ; C9.1 33.4,69.31 33.4,70.02 R3.1
  Bottom Layer w0.254: U19.6 81.25,116.06 64.67,116.06 U17.6 61.25,116.06 44.67,116.06 U10.6 41.25,116.06 24.67,116.06 U9.6 21.25,116.06 4.67,116.06 U8.6
$1N832: length 12.3
  Top Layer w0.254: R2.1 36.66,56.94 38.67,56.94 39.37,56.25 39.37,52.94 38.86,52.44 v1(38.86,52.35) ; U2.8 35.88,51.46 v1(35.01,51.46)
  Bottom Layer w0.254: v1(35.01,51.46) 35.91,52.35 v1(38.86,52.35)
$1N837: length 17.7
  Top Layer w0.203: v1(38.86,48.12) 38.11,48.87 37.24,48.87 37,49.11 37,49.52 36.98,49.54 ; C6.1 37.37,42.19 37.54,42.19
  Top Layer w0.254: SW1.2 35.27,42.08 35.22,42.12 ; 35.22,42.12 33.29,42.12 R1.1 30.93,42.07 TP7.1 ; 35.22,42.12 C6.1 ; v1(38.86,42.78) 38.27,42.19 37.54,42.19
  Bottom Layer w0.254: v1(38.86,48.12) v1(38.86,42.78)
$1N8820: length 2.2
  Top Layer w0.254: 34.6,63.79 34.34,63.79 34.29,63.74 33.76,64.27 C8.1
$1N10873: length 8
  Top Layer w0.203: TP4.1 31.62,71.11 33.82,71.11 R3.2
  Top Layer w0.254: 37.04,72.17 37.04,70.98 36.54,70.48 R4.1 R3.2
$1N12732: length 3.3
  Top Layer w0.254: U15.2 U15.1 34.2,72.47 R5.1

## Copper pours and planes (outline as drawn; the poured copper is in the pictures)
+3V3 on Top Layer: 23.95,109.78 26.87,109.78 26.87,108.76 23.95,108.76
+3V3 on Top Layer: 32.21,57.73 35.51,57.73 35.51,51.12 32.21,51.12
+5V on Top Layer: 36.27,49.8 38.17,49.8 38.17,44.67 36.27,44.67
GND on Top Layer: -4.44,122.54 103.5,122.54 103.5,-4.46 -4.44,-4.46
GND on Top Layer: 37.4,51.81 38.56,51.81 38.56,49.27 37.4,49.27
GND on Top Layer: 32.21,50.95 36.01,50.95 36.01,44.8 32.21,44.8
GND on Bottom Layer: -4.7,122.67 103.63,122.67 103.63,-2.68 -4.7,-2.68
GND on Bottom Layer: -4.32,122.29 103.25,122.29 103.25,-3.32 -4.32,-3.32
GND on Inner1: -3.94,122.92 105.54,122.92 105.54,-2.17 -3.94,-2.17
GND on Inner2: -4.32,121.65 107.31,121.65 107.31,-2.17 -4.32,-2.17
$1N831 on Top Layer: 36.27,55.7 37.67,55.7 37.67,51.68 36.27,51.68

Small or netless copper shapes (teardrops, artwork), in the pictures only: 128 on Top Layer, 130 on Bottom Layer

## Text on the board
Bottom Silkscreen Layer: COMPUTE BASE BOARD 5X V101 | SEMANTIC BOAT PROJECT
Top Silkscreen Layer: VREF | VOCM | VDDA | VBAT | 3V3 | +5V | SAL | SEN | SDT | IDT | ICL | SCL | ON | SE
